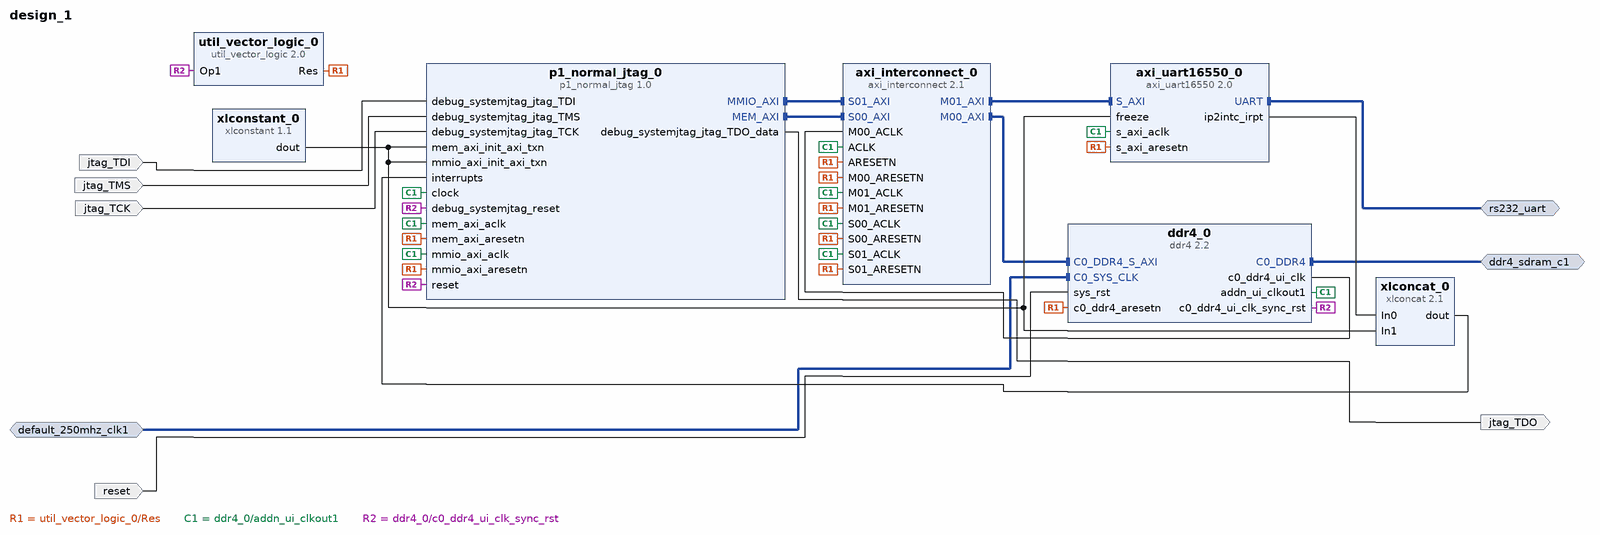
[diagram p0: block diagram of the top level]
# Vivado block design design_1, xcvu9p-flga2104-2L-e, Vivado 2017.4
create_bd_design design_1

create_bd_intf_port -mode Master -vlnv xilinx.com:interface:ddr4_rtl:1.0 ddr4_sdram_c1
create_bd_intf_port -mode Slave -vlnv xilinx.com:interface:diff_clock_rtl:1.0 default_250mhz_clk1
set_property -dict {CONFIG.FREQ_HZ 250000000} [get_bd_intf_ports default_250mhz_clk1]
create_bd_intf_port -mode Master -vlnv xilinx.com:interface:uart_rtl:1.0 rs232_uart
create_bd_port -dir I -type rst reset
set_property -dict {CONFIG.POLARITY ACTIVE_HIGH} [get_bd_ports reset]
create_bd_port -dir I jtag_TDI
create_bd_port -dir I jtag_TMS
create_bd_port -dir I jtag_TCK
create_bd_port -dir O jtag_TDO

create_bd_cell -type ip -vlnv xilinx.com:ip:axi_interconnect:2.1 axi_interconnect_0
set_property -dict {CONFIG.NUM_SI 2 CONFIG.NUM_MI 2} [get_bd_cells axi_interconnect_0]
create_bd_cell -type ip -vlnv xilinx.com:ip:axi_uart16550:2.0 axi_uart16550_0
set_property -dict {CONFIG.USE_BOARD_FLOW true CONFIG.UART_BOARD_INTERFACE rs232_uart} [get_bd_cells axi_uart16550_0]
create_bd_cell -type ip -vlnv xilinx.com:ip:ddr4:2.2 ddr4_0
set_property -dict [list \
  CONFIG.RESET_BOARD_INTERFACE reset \
  CONFIG.C0_CLOCK_BOARD_INTERFACE default_250mhz_clk1 \
  CONFIG.C0_DDR4_BOARD_INTERFACE ddr4_sdram_c1 \
  CONFIG.ADDN_UI_CLKOUT1_FREQ_HZ 25 \
] [get_bd_cells ddr4_0]
create_bd_cell -type ip -vlnv xilinx.com:ip:util_vector_logic:2.0 util_vector_logic_0
set_property -dict {CONFIG.C_SIZE 1 CONFIG.C_OPERATION not} [get_bd_cells util_vector_logic_0]
create_bd_cell -type ip -vlnv xilinx.com:ip:xlconcat:2.1 xlconcat_0
create_bd_cell -type ip -vlnv xilinx.com:ip:xlconstant:1.1 xlconstant_0
set_property -dict {CONFIG.CONST_VAL 0} [get_bd_cells xlconstant_0]
create_bd_cell -type ip -vlnv user.org:user:p1_normal_jtag:1.0 p1_normal_jtag_0
set_property -dict [list \
  CONFIG.C_MMIO_AXI_TARGET_SLAVE_BASE_ADDR 0x60000000 \
  CONFIG.C_MEM_AXI_TARGET_SLAVE_BASE_ADDR 0x40000000 \
] [get_bd_cells p1_normal_jtag_0]

# ---- connections ----

connect_bd_intf_net [get_bd_intf_pins axi_interconnect_0/M00_AXI] [get_bd_intf_pins ddr4_0/C0_DDR4_S_AXI]
connect_bd_intf_net [get_bd_intf_pins axi_interconnect_0/M01_AXI] [get_bd_intf_pins axi_uart16550_0/S_AXI]
connect_bd_intf_net [get_bd_intf_pins p1_normal_jtag_0/MMIO_AXI] [get_bd_intf_pins axi_interconnect_0/S01_AXI]
connect_bd_intf_net [get_bd_intf_pins p1_normal_jtag_0/MEM_AXI] [get_bd_intf_pins axi_interconnect_0/S00_AXI]
connect_bd_intf_net [get_bd_intf_ports ddr4_sdram_c1] [get_bd_intf_pins ddr4_0/C0_DDR4]
connect_bd_intf_net -intf_net default_250mhz_clk1_1 [get_bd_intf_ports default_250mhz_clk1] [get_bd_intf_pins ddr4_0/C0_SYS_CLK]
connect_bd_intf_net [get_bd_intf_ports rs232_uart] [get_bd_intf_pins axi_uart16550_0/UART]
connect_bd_net -net ARESETN_1 [get_bd_pins util_vector_logic_0/Res] \
  [get_bd_pins axi_interconnect_0/ARESETN] [get_bd_pins axi_interconnect_0/M00_ARESETN] \
  [get_bd_pins axi_interconnect_0/M01_ARESETN] [get_bd_pins axi_interconnect_0/S00_ARESETN] \
  [get_bd_pins axi_interconnect_0/S01_ARESETN] [get_bd_pins axi_uart16550_0/s_axi_aresetn] \
  [get_bd_pins ddr4_0/c0_ddr4_aresetn] [get_bd_pins p1_normal_jtag_0/mem_axi_aresetn] \
  [get_bd_pins p1_normal_jtag_0/mmio_axi_aresetn]
connect_bd_net -net S00_ACLK_1 [get_bd_pins ddr4_0/c0_ddr4_ui_clk] [get_bd_pins axi_interconnect_0/M00_ACLK]
connect_bd_net [get_bd_pins axi_uart16550_0/ip2intc_irpt] [get_bd_pins xlconcat_0/In0]
connect_bd_net [get_bd_pins ddr4_0/addn_ui_clkout1] \
  [get_bd_pins axi_interconnect_0/ACLK] [get_bd_pins axi_interconnect_0/M01_ACLK] [get_bd_pins axi_interconnect_0/S00_ACLK] \
  [get_bd_pins axi_interconnect_0/S01_ACLK] [get_bd_pins axi_uart16550_0/s_axi_aclk] [get_bd_pins p1_normal_jtag_0/clock] \
  [get_bd_pins p1_normal_jtag_0/mem_axi_aclk] [get_bd_pins p1_normal_jtag_0/mmio_axi_aclk]
connect_bd_net [get_bd_pins ddr4_0/c0_ddr4_ui_clk_sync_rst] \
  [get_bd_pins util_vector_logic_0/Op1] [get_bd_pins p1_normal_jtag_0/reset] \
  [get_bd_pins p1_normal_jtag_0/debug_systemjtag_reset]
connect_bd_net [get_bd_ports reset] [get_bd_pins ddr4_0/sys_rst]
connect_bd_net [get_bd_pins xlconcat_0/dout] [get_bd_pins p1_normal_jtag_0/interrupts]
connect_bd_net [get_bd_pins xlconstant_0/dout] \
  [get_bd_pins axi_uart16550_0/freeze] [get_bd_pins xlconcat_0/In1] [get_bd_pins p1_normal_jtag_0/mem_axi_init_axi_txn] \
  [get_bd_pins p1_normal_jtag_0/mmio_axi_init_axi_txn]
connect_bd_net [get_bd_pins p1_normal_jtag_0/debug_systemjtag_jtag_TDO_data] [get_bd_ports jtag_TDO]
connect_bd_net [get_bd_ports jtag_TDI] [get_bd_pins p1_normal_jtag_0/debug_systemjtag_jtag_TDI]
connect_bd_net [get_bd_ports jtag_TMS] [get_bd_pins p1_normal_jtag_0/debug_systemjtag_jtag_TMS]
connect_bd_net [get_bd_ports jtag_TCK] [get_bd_pins p1_normal_jtag_0/debug_systemjtag_jtag_TCK]

# ---- address map ----
assign_bd_address -offset 0x60000000 -range 64K -target_address_space [get_bd_addr_spaces p1_normal_jtag_0/MMIO_AXI] [get_bd_addr_segs axi_uart16550_0/S_AXI/Reg]
assign_bd_address -offset 0x80000000 -range 2G -target_address_space [get_bd_addr_spaces p1_normal_jtag_0/MMIO_AXI] [get_bd_addr_segs ddr4_0/C0_DDR4_MEMORY_MAP/C0_DDR4_ADDRESS_BLOCK]

validate_bd_design
save_bd_design
